# Altium schematic sheet 09_1V8 LDO & 3V3 AO Rails.SchDoc: C200
size 297 x 209 mm; Page Create Date: March  8, 1995; Page Number: 9; Page Size: A4; Comment: radxa_1010; Page Count: 21; RevCode: V1.11; Doc: 09_1V8 LDO & 3V3 AO Rails; DsnPath: D:\WMS\C200\CC122\对外\C200 V1.11.DSN; SchematicName: c200; PageName: 09_1V8 LDO & 3V3 AO Rails; PageSize: A4; TopSchematic: True
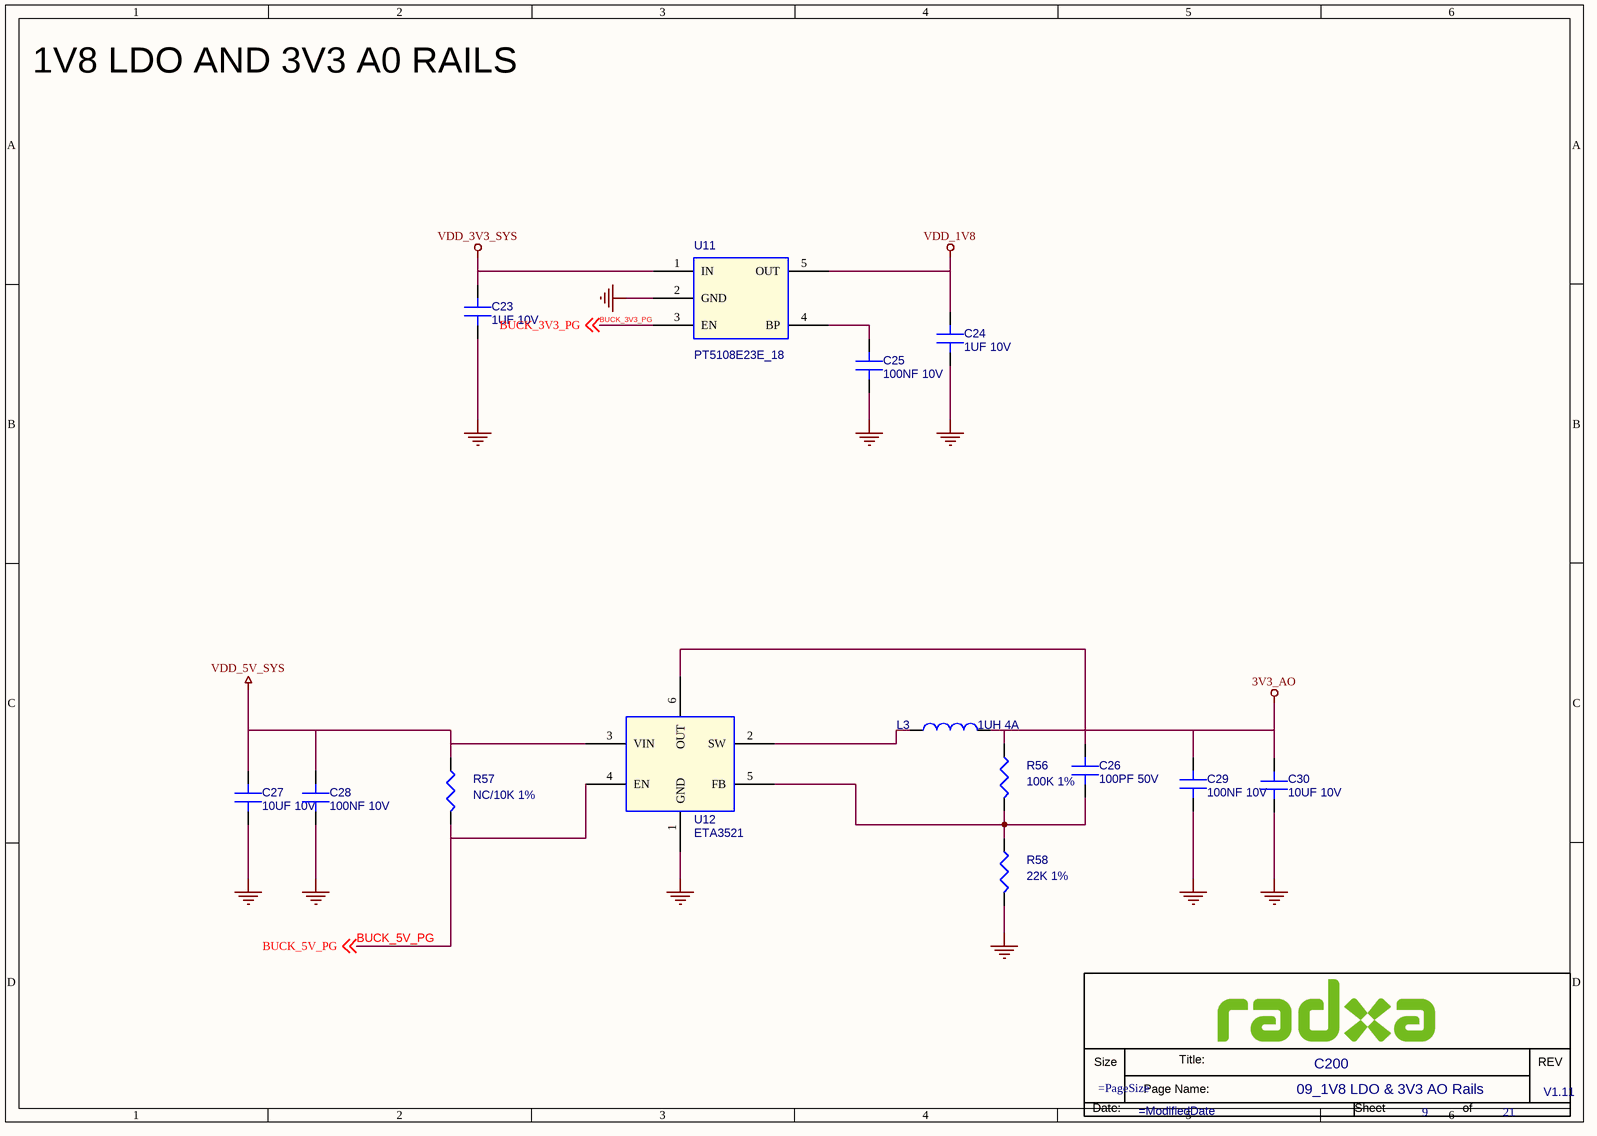
[diagram p0: 09_1V8 LDO & 3V3 AO Rails.SchDoc]

## Parts
*  Doc: 09_1V8 LDO & 3V3 AO Rails  RevCode: V1.11  Title: C200  Page Number: 9  Page Count: 21  (hidden comment: radxa_1010)  (graphical)
C23  1UF 10V  [C0402]
C24  1UF 10V  [C0402]
C25  100NF 10V  [C0402]
C26  100PF 50V  [C0402]
C27  10UF 10V  [C0603]
C28  100NF 10V  [C0402]
C29  100NF 10V  [C0402]
C30  10UF 10V  [C0603]
L3  1UH 4A  [L_2016]
R56  100K 1%  [R0402]
R57  NC/10K 1%  [R0402]
R58  22K 1%  [R0402]
U11  PT5108E23E_18  [SOT23_5]
U12  ETA3521  [SOT563]

## Nets
3V3_AO: C26.1(A) C29.1(A) C30.1(A) L3.2 R56.1 U12.6(OUT)
GND: C23.2(B) C24.2(B) C25.2(B) C27.2(B) C28.2(B) C29.2(B) C30.2(B) R58.2 U11.2(GND) U12.1(GND)
VDD_1V8: C24.1(A) U11.5(OUT)
VDD_3V3_SYS: C23.1(A) U11.1(IN)
VDD_5V_SYS: C27.1(A) C28.1(A) R57.1 U12.3(VIN)
BUCK_3V3_PG: U11.3(EN) ; off-sheet BUCK_3V3_PG
BUCK_5V_PG: R57.2 U12.4(EN) ; off-sheet BUCK_5V_PG
NetC25_1: C25.1(A) U11.4(BP)
NetC26_2: C26.2(B) R56.2 R58.1 U12.5(FB)
NetL3_1: L3.1 U12.2(SW)

## Notes on the sheet
- 1V8 LDO AND 3V3 A0 RAILS
- (in symbol radxa_1010) Size; Title:; REV; Page Name:; Date:; Sheet; of

## Library data of the parts
C23 = C: SMD  0402  1UF  10V  X5R  ±10%  ROHS; PARTS: 1; Part Reference: C23; Part Number: A1C01.00063; OriginalSymbolOrigin: (0,30); PKG_TYPE: CAP2-100-250; LEVEL: STD; PINSWAP: (A,B); Value: 1UF 10V; Part Type: 陶瓷电容; PCB Footprint: C0402
C24 = C: SMD  0402  1UF  10V  X5R  ±10%  ROHS; PARTS: 1; Part Reference: C24; Part Number: A1C01.00063; OriginalSymbolOrigin: (0,30); PKG_TYPE: CAP2-100-250; LEVEL: STD; PINSWAP: (A,B); Value: 1UF 10V; Part Type: 陶瓷电容; PCB Footprint: C0402
C25 = C: SMD  0402  100NF  10V  X5R  ±10%  ROHS; PARTS: 1; Part Reference: C25; Part Number: A1C01.00163; OriginalSymbolOrigin: (0,30); PKG_TYPE: CAP2-100-250; LEVEL: STD; PINSWAP: (A,B); Value: 100NF 10V; Part Type: 陶瓷电容; PCB Footprint: C0402
C26 = C: SMD  0402  100PF  50V  NPO  ±5%  ROHS; PARTS: 1; Part Reference: C26; Part Number: A1C01.00156; OriginalSymbolOrigin: (0,30); PKG_TYPE: CAP2-100-250; LEVEL: STD; PINSWAP: (A,B); Value: 100PF 50V; Part Type: 陶瓷电容; PCB Footprint: C0402
C27 = C: SMD  0603  10UF  10V  X5R  ±10%  ROHS; PARTS: 1; Part Reference: C27; Part Number: A1C01.00270; OriginalSymbolOrigin: (0,30); PKG_TYPE: CAP2-100-250; LEVEL: STD; PINSWAP: (A,B); Value: 10UF 10V; Part Type: 陶瓷电容; PCB Footprint: C0603
C28 = C: SMD  0402  100NF  10V  X5R  ±10%  ROHS; PARTS: 1; Part Reference: C28; Part Number: A1C01.00163; OriginalSymbolOrigin: (0,30); PKG_TYPE: CAP2-100-250; LEVEL: STD; PINSWAP: (A,B); Value: 100NF 10V; Part Type: 陶瓷电容; PCB Footprint: C0402
C29 = C: SMD  0402  100NF  10V  X5R  ±10%  ROHS; PARTS: 1; Part Reference: C29; Part Number: A1C01.00163; OriginalSymbolOrigin: (0,30); PKG_TYPE: CAP2-100-250; LEVEL: STD; PINSWAP: (A,B); Value: 100NF 10V; Part Type: 陶瓷电容; PCB Footprint: C0402
C30 = C: SMD  0603  10UF  10V  X5R  ±10%  ROHS; PARTS: 1; Part Reference: C30; Part Number: A1C01.00270; OriginalSymbolOrigin: (0,30); PKG_TYPE: CAP2-100-250; LEVEL: STD; PINSWAP: (A,B); Value: 10UF 10V; Part Type: 陶瓷电容; PCB Footprint: C0603
L3 = L: SMD  带屏蔽  2*1.6*1.0mm  1UH  4A  ±20%  RHP201610T-1R0MT  仁芯微  ROHS; Part Reference: L3; Part Number: A1L01.00125; Temp Coeff: -55℃ to +125℃; PCB Footprint: L_2016; Value: 1UH 4A; Part Type: 贴片功率电感
R56 = R: SMD  0402  100K  1/16W  ±1%  ROHS; Part Reference: R56; Part Number: A1R01.00031; Temp Coeff: －55℃ ~ ＋155℃; PCB Footprint: R0402; Value: 100K 1%; Part Type: 贴片电阻
R57 = R: SMD  0402  10K  1/16W  ±1%  ROHS; Part Reference: R57; Part Number: A1R01.00222; PCB Footprint: R0402; Value: NC/10K 1%; Part Type: 贴片电阻
R58 = R: SMD  0402  22K  1/16W  ±1%  ROHS; Part Reference: R58; Part Number: A1R01.00083; PCB Footprint: R0402; Value: 22K 1%; Part Type: 贴片电阻
U11 = PT5108E23E_18: SMD  LDO，固定输出1.8V  PT5108E23E-18  SOT23-5  Powtech  ROHS; Part Reference: U11; Part Number: A1I01.00016; PCB Footprint: SOT23_5; Value: PT5108E23E_18; Part Type: 集成电路/模块
U12 = ETA3521: SMD  降压型DCDC,2MHz, 4A  ETA3521  SOT563  钰泰  ROHS; Part Reference: U12; Part Number: A1I01.00040; Value: ETA3521; Part Type: 集成电路/模块; PCB Footprint: SOT563
* = radxa_1010: Page Create Date: March  8, 1995; Page Size: =PageSize; Page Modify Date: =ModifiedDate